# Altium schematic sheet Ballast Resistors.SchDoc
size 406 x 304 mm; SheetNumber: 12; SheetTotal: 22
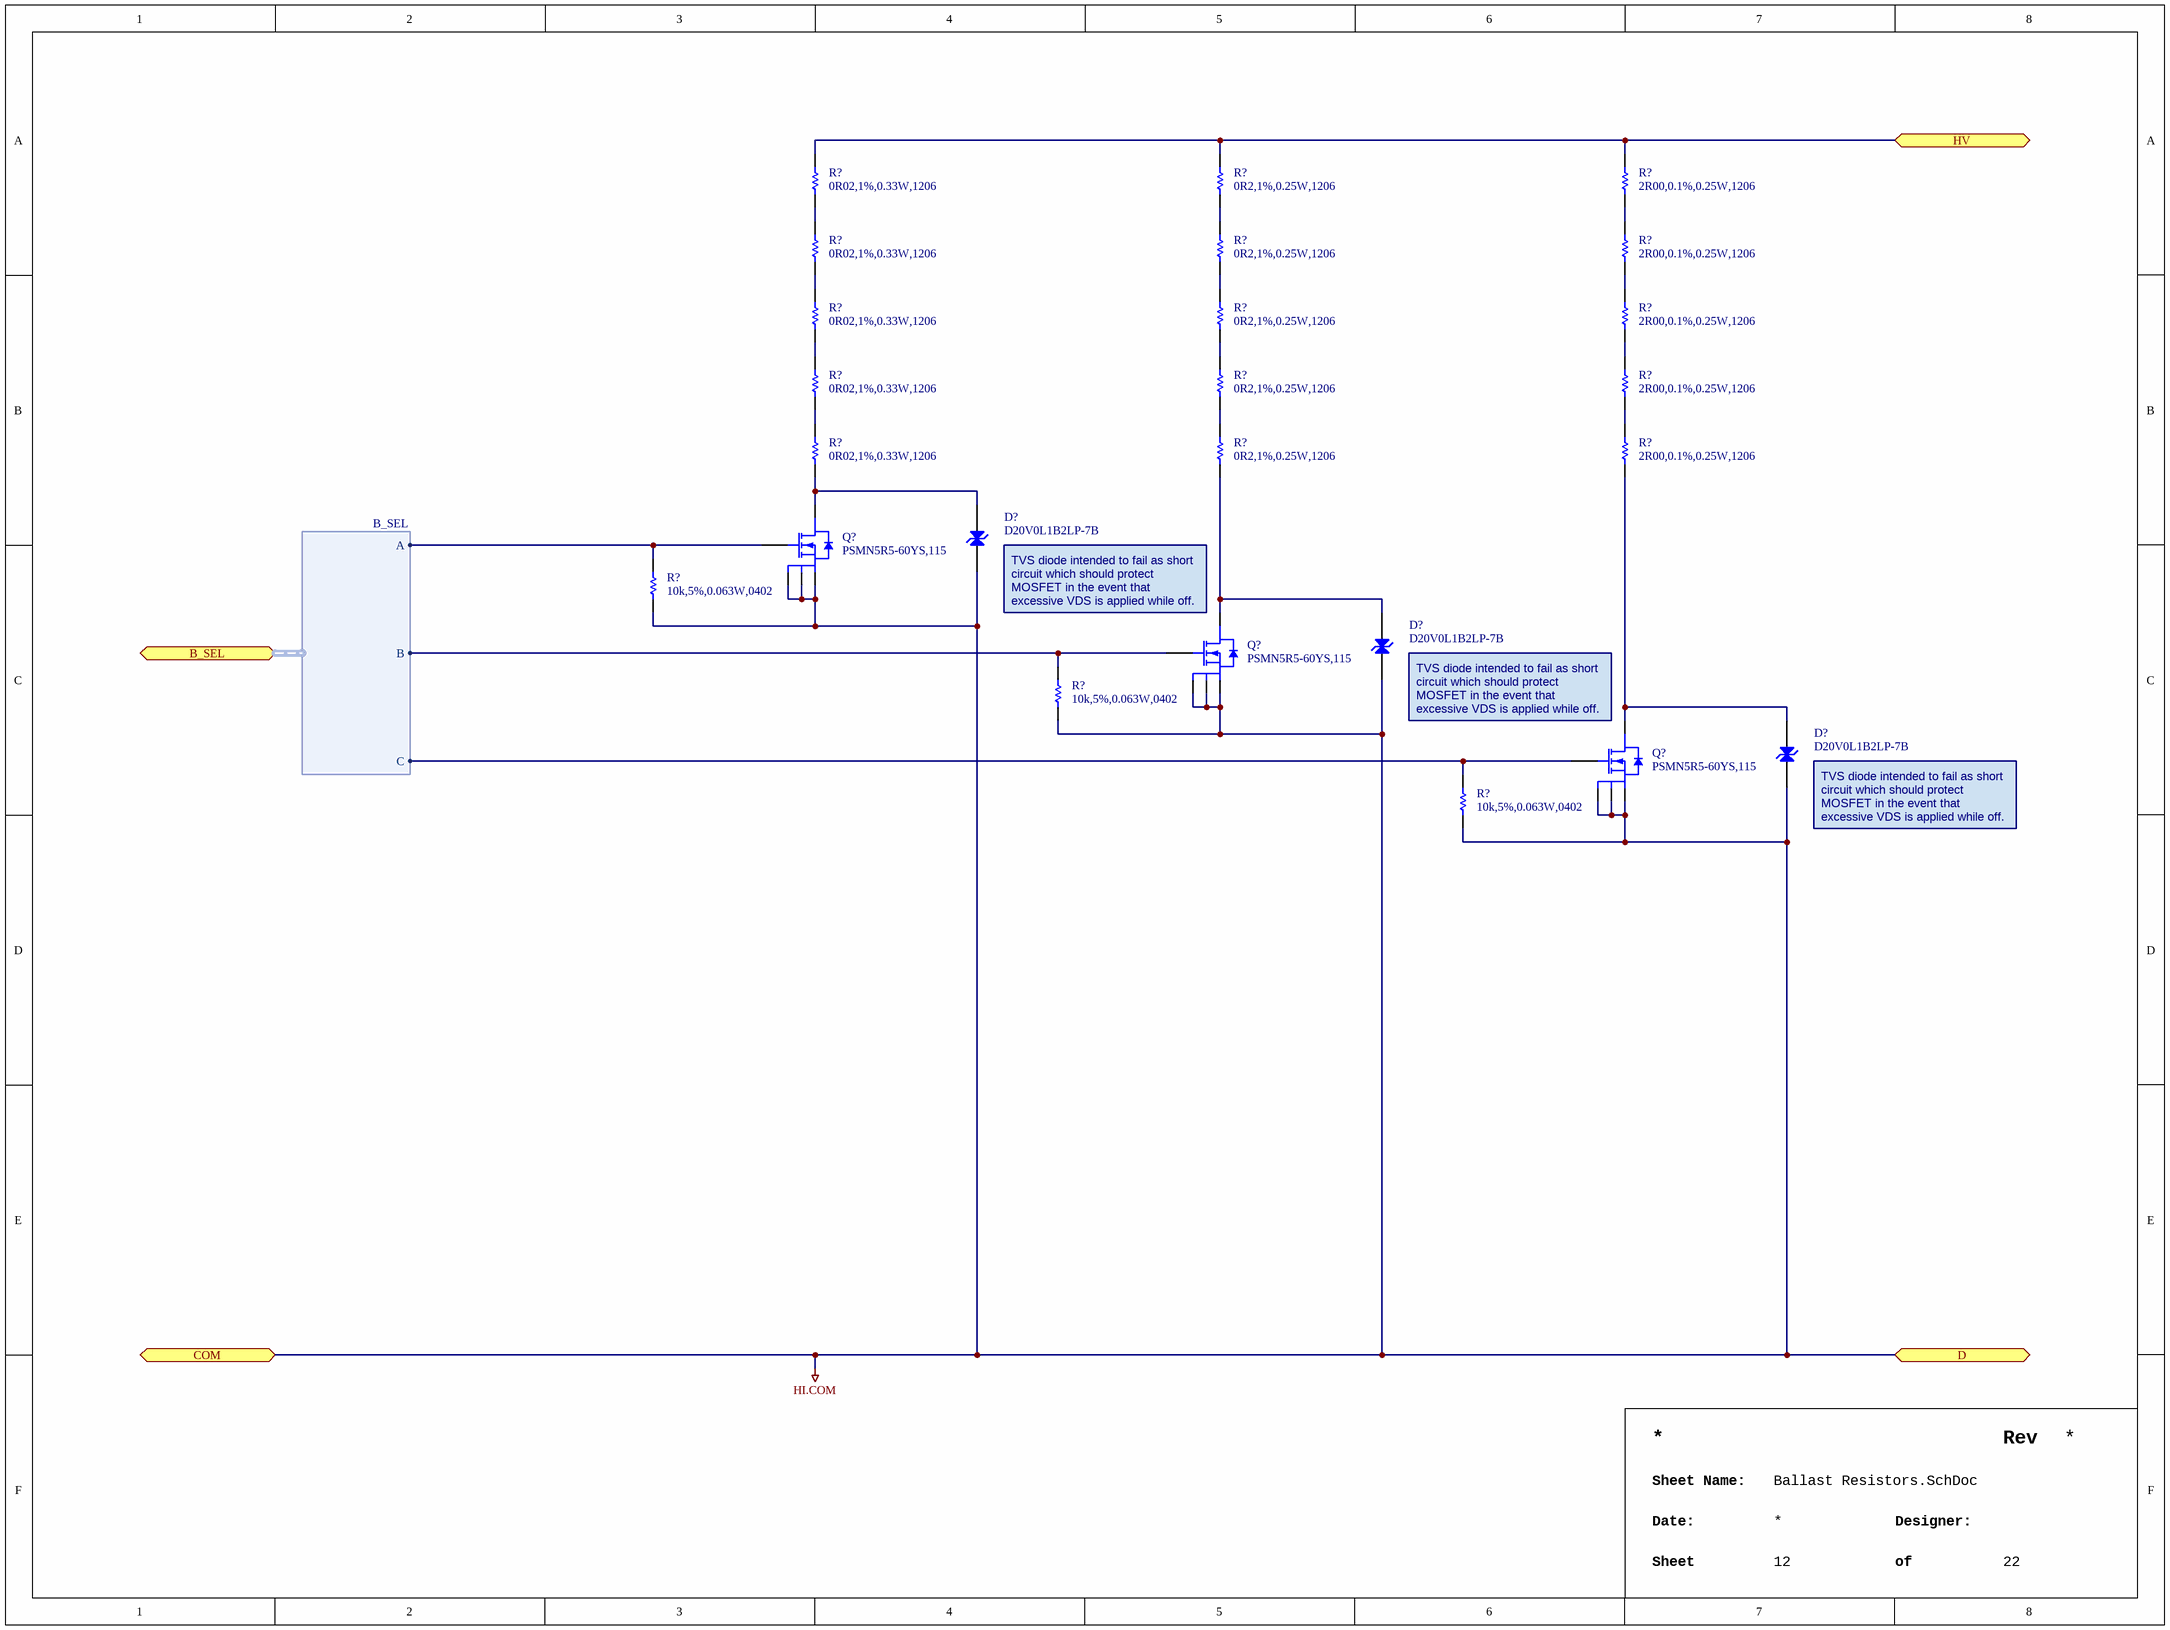
[diagram p0: Ballast Resistors.SchDoc]

## Parts
(Parts that share a designator on the sheet are numbered #1, #2 ... from top to bottom, then left to right.)
D?#1  D20V0L1B2LP-7B  [DFN65P100X50-2N]
D?#2  D20V0L1B2LP-7B  [DFN65P100X50-2N]
D?#3  D20V0L1B2LP-7B  [DFN65P100X50-2N]
Q?#1  PSMN5R5-60YS,115  [DPAK127P600X120-5N]
Q?#2  PSMN5R5-60YS,115  [DPAK127P600X120-5N]
Q?#3  PSMN5R5-60YS,115  [DPAK127P600X120-5N]
R?#1  0R02,1%,0.33W,1206  [RES3216X06N]
R?#2  0R2,1%,0.25W,1206  [RES3216X06N]
R?#3  2R00,0.1%,0.25W,1206  [RES3216X06N]
R?#4  0R02,1%,0.33W,1206  [RES3216X06N]
R?#5  0R2,1%,0.25W,1206  [RES3216X06N]
R?#6  2R00,0.1%,0.25W,1206  [RES3216X06N]
R?#7  0R02,1%,0.33W,1206  [RES3216X06N]
R?#8  0R2,1%,0.25W,1206  [RES3216X06N]
R?#9  2R00,0.1%,0.25W,1206  [RES3216X06N]
R?#10  0R02,1%,0.33W,1206  [RES3216X06N]
R?#11  0R2,1%,0.25W,1206  [RES3216X06N]
R?#12  2R00,0.1%,0.25W,1206  [RES3216X06N]
R?#13  0R02,1%,0.33W,1206  [RES3216X06N]
R?#14  0R2,1%,0.25W,1206  [RES3216X06N]
R?#15  2R00,0.1%,0.25W,1206  [RES3216X06N]
R?#16  10k,5%,0.063W,0402  [RESC1005X04N]
R?#17  10k,5%,0.063W,0402  [RESC1005X04N]
R?#18  10k,5%,0.063W,0402  [RESC1005X04N]

## Ports
B_SEL (bidir, harness B_SEL), COM (bidir), D (bidir), HV (bidir)

## Harnesses
B_SEL: C, B, A

## Nets
HI.COM: D?#1.2(A) D?#2.2(A) D?#3.2(A) Q?#1.1(S) Q?#1.2(S) Q?#1.3(S) Q?#2.1(S) Q?#2.2(S) Q?#2.3(S) Q?#3.1(S) Q?#3.2(S) Q?#3.3(S) R?#16.1 R?#17.1 R?#18.1 ; port D, port COM
HV: R?#1.2 R?#2.2 R?#3.2 ; port HV
NetD?#1_1: D?#1.1(K) Q?#1.5(D) R?#13.1
NetD?#2_1: D?#2.1(K) Q?#2.5(D) R?#14.1
NetD?#3_1: D?#3.1(K) Q?#3.5(D) R?#15.1
NetQ?#1_4: Q?#1.4(G) R?#16.2 ; port B_SEL.A
NetQ?#2_4: Q?#2.4(G) R?#17.2 ; port B_SEL.B
NetQ?#3_4: Q?#3.4(G) R?#18.2 ; port B_SEL.C
NetR?#1_1: R?#1.1 R?#4.2
NetR?#2_1: R?#2.1 R?#5.2
NetR?#3_1: R?#3.1 R?#6.2
NetR?#4_1: R?#4.1 R?#7.2
NetR?#5_1: R?#5.1 R?#8.2
NetR?#6_1: R?#6.1 R?#9.2
NetR?#7_1: R?#7.1 R?#10.2
NetR?#8_1: R?#8.1 R?#11.2
NetR?#9_1: R?#9.1 R?#12.2
NetR?#10_1: R?#10.1 R?#13.2
NetR?#11_1: R?#11.1 R?#14.2
NetR?#12_1: R?#12.1 R?#15.2

## Notes on the sheet
- (near Q?#2) TVS diode intended to fail as short circuit which should protect MOSFET in the event that excessive VDS is applied while off.
- (near Q?#3) TVS diode intended to fail as short circuit which should protect MOSFET in the event that excessive VDS is applied while off.
- (near D?#3) TVS diode intended to fail as short circuit which should protect MOSFET in the event that excessive VDS is applied while off.
- Rev
- Sheet Name:
- Date:
- Sheet
- Designer:
- of

## Library data of the parts
D?#1-D?#3 = DIODE,TVS,20V,SMD,BIDIR: 34V Clamp 2A (8/20ï¿½s) Ipp Tvs Diode Surface Mount X1-DFN1006-2; Manufacturer 1: Diodes Incorporated; Vendor 1 Part Number: D20V0L1B2LP-7BDICT-ND; Vendor 1: Digikey; Part Name: DIODE,TVS,20V,SMD,BIDIR; CreatedBy: Judd Foster; HelpURL: https://www.diodes.com/assets/Datasheets/D20V0L1B2LP.pdf; Manufacturer 1 Part Number: D20V0L1B2LP-7B
Q?#1-Q?#3 = MOSFET,N Ch,60V,100A: N-Channel 60V 100A (Tc) 130W (Tc) Surface Mount LFPAK56, Power-SO8; Manufacturer 1: Nexperia USA Inc.; Vendor 1 Part Number: 1727-4284-1-ND; Vendor 1: Digikey; Part Name: MOSFET,N Ch,60V,100A; CreatedBy: Judd Foster; HelpURL: https://assets.nexperia.com/documents/data-sheet/PSMN5R5-60YS.pdf; Manufacturer 1 Part Number: PSMN5R5-60YS,115
R?#1 R?#4 R?#7 R?#10 R?#13 = RES,0R02,1%,0.33W,1206: 333mW 20mÎ© 200V Â±1000ppm/â„ƒ Thick Film Resistor Â±1% 1206 Chip Resistor - Surface Mount ROHS; Manufacturer 1: UNI-ROYAL; Manufacturer 1 Part Number: 1206W3F200MT5E; Vendor 1 Part Number: C2765435; Vendor 1: LCSC; Value: 0.02; Part Name: RES,0R02,1%,0.33W,1206; CreatedBy: Judd Foster; HelpURL: https://www.lcsc.com/datasheet/C2765435.pdf
R?#2 R?#5 R?#8 R?#11 R?#14 = RES,0R2,1%,0.25W,1206: 250mW 200mÎ© 500V Â±600ppm/â„ƒ Thick Film Resistor Â±1% 1206 Chip Resistor - Surface Mount ROHS; Manufacturer 1: FOJAN; Manufacturer 1 Part Number: FRL1206FR200TS; Vendor 1 Part Number: C2907350; Vendor 1: LCSC; Value: 0.2; Part Name: RES,0R2,1%,0.25W,1206; CreatedBy: Judd Foster; HelpURL: https://www.lcsc.com/datasheet/C2907350.pdf
R?#3 R?#6 R?#9 R?#12 R?#15 = RES,2R000,0.1%,0.25W,1206: 250mW 2Î© 200V Â±25ppm/â„ƒ Thin Film Resistor Â±0.1% 1206 Chip Resistor - Surface Mount ROHS; Manufacturer 1: Viking; Manufacturer 1 Part Number: ARG06BTC0020; Vendor 1 Part Number: C37635715; Vendor 1: LCSC; Value: 2R; Part Name: RES,2R000,0.1%,0.25W,1206; CreatedBy: Judd Foster; HelpURL: https://www.lcsc.com/datasheet/C37635715.pdf
R?#16-R?#18 = RES,10k,5%,0.063W,0402: 10 kOhms ï¿½5% 0.063W, 1/16W Chip Resistor 0402 (1005 Metric) Automotive AEC-Q200 Thick Film; Manufacturer 1: Stackpole Electronics Inc; Manufacturer 1 Part Number: RMCF0402JT10K0; Vendor 1 Part Number: RMCF0402JT10K0CT-ND; Vendor 1: DIgikey; Part Name: RES,10k,5%,0.063W,0402; CreatedBy: Judd Foster; HelpURL: https://www.seielect.com/catalog/sei-rmcf_rmcp.pdf; Value: 10k